# Altium schematic sheet Digi_PID_Cltr.SchDoc
size A3
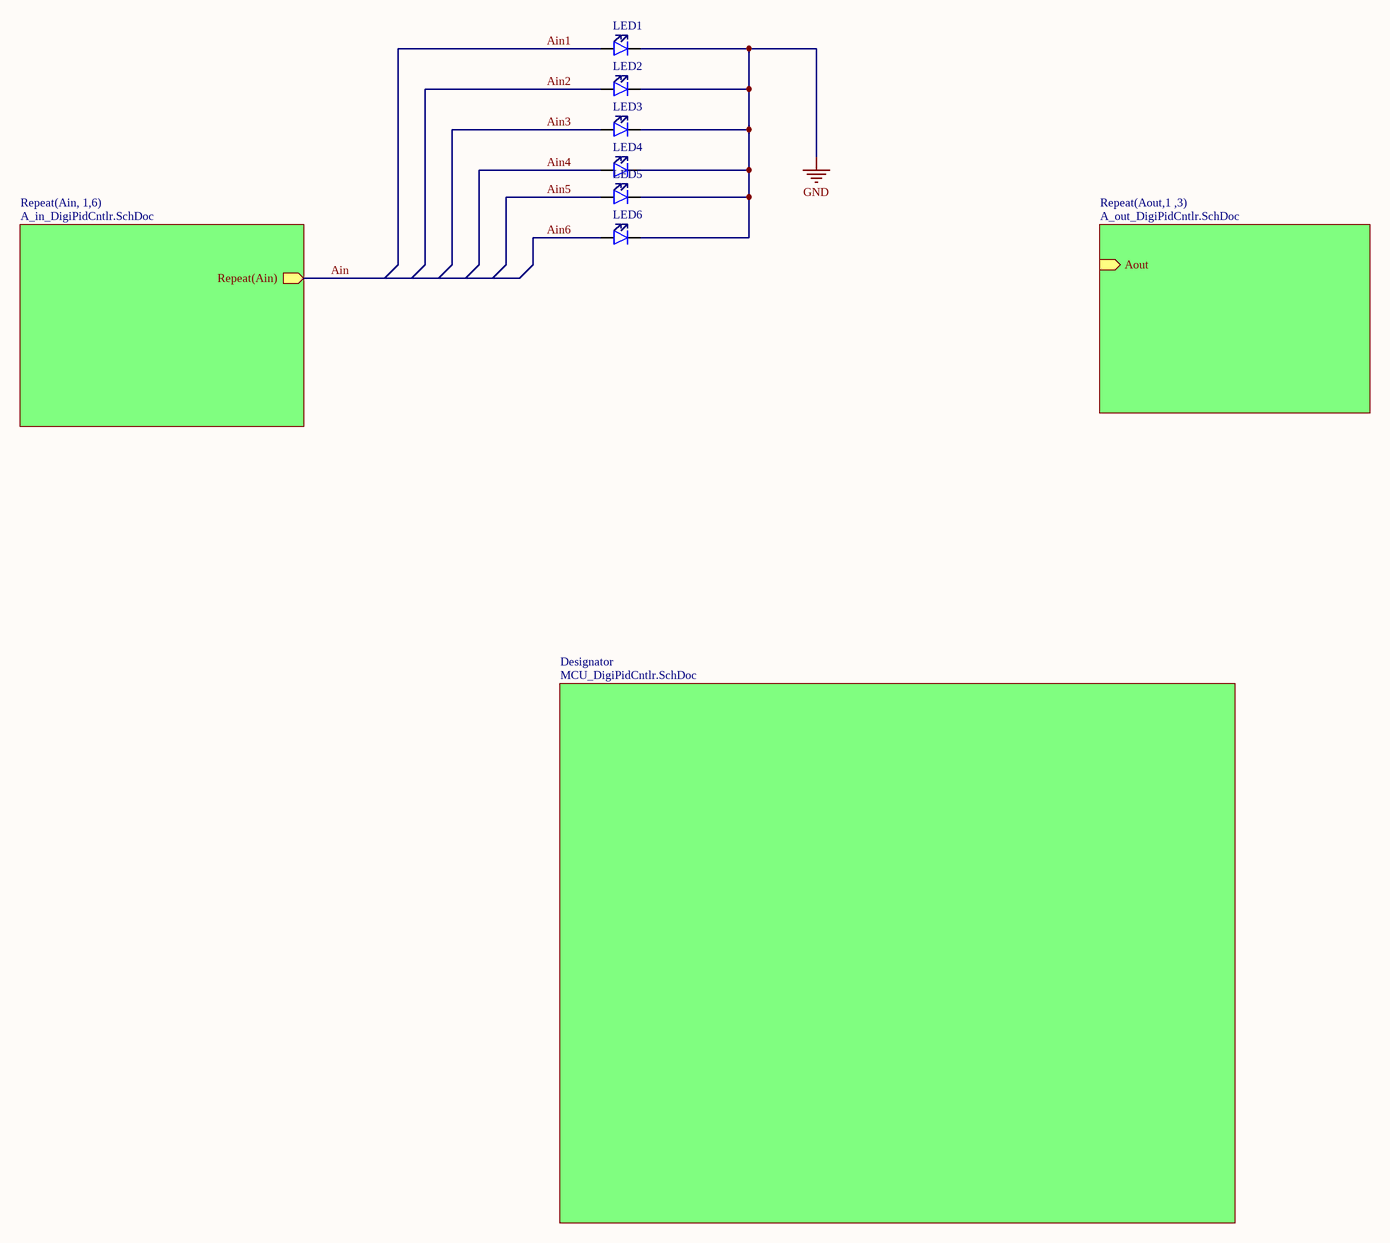
[diagram p0: Digi_PID_Cltr.SchDoc]

## Parts
LED1  LED  [SMD LED 0805]  (value not drawn)
LED2  LED  [SMD LED 0805]  (value not drawn)
LED3  LED  [SMD LED 0805]  (value not drawn)
LED4  LED  [SMD LED 0805]  (value not drawn)
LED5  LED  [SMD LED 0805]  (value not drawn)
LED6  LED  [SMD LED 0805]  (value not drawn)

## Sub-sheets
Designator = MCU_DigiPidCntlr.SchDoc: no entries
Repeat(Ain, 1,6) = A_in_DigiPidCntlr.SchDoc: Repeat(Ain) (out)
Repeat(Aout,1 ,3) = A_out_DigiPidCntlr.SchDoc: Aout (in)

## Nets
GND: LED1.K LED2.K LED3.K LED4.K LED5.K LED6.K
Ain: sheet Repeat(Ain, 1,6)/Repeat(Ain)
Ain1: LED1.A
Ain2: LED2.A
Ain3: LED3.A
Ain4: LED4.A
Ain5: LED5.A
Ain6: LED6.A

## Library data of the parts
LED1-LED6 = LED: Color: *; Package: *; Comment_1: *